# Altium schematic sheet MCU_Transceiver_Board.SchDoc
size B; SheetNumber: 1; SheetTotal: 6
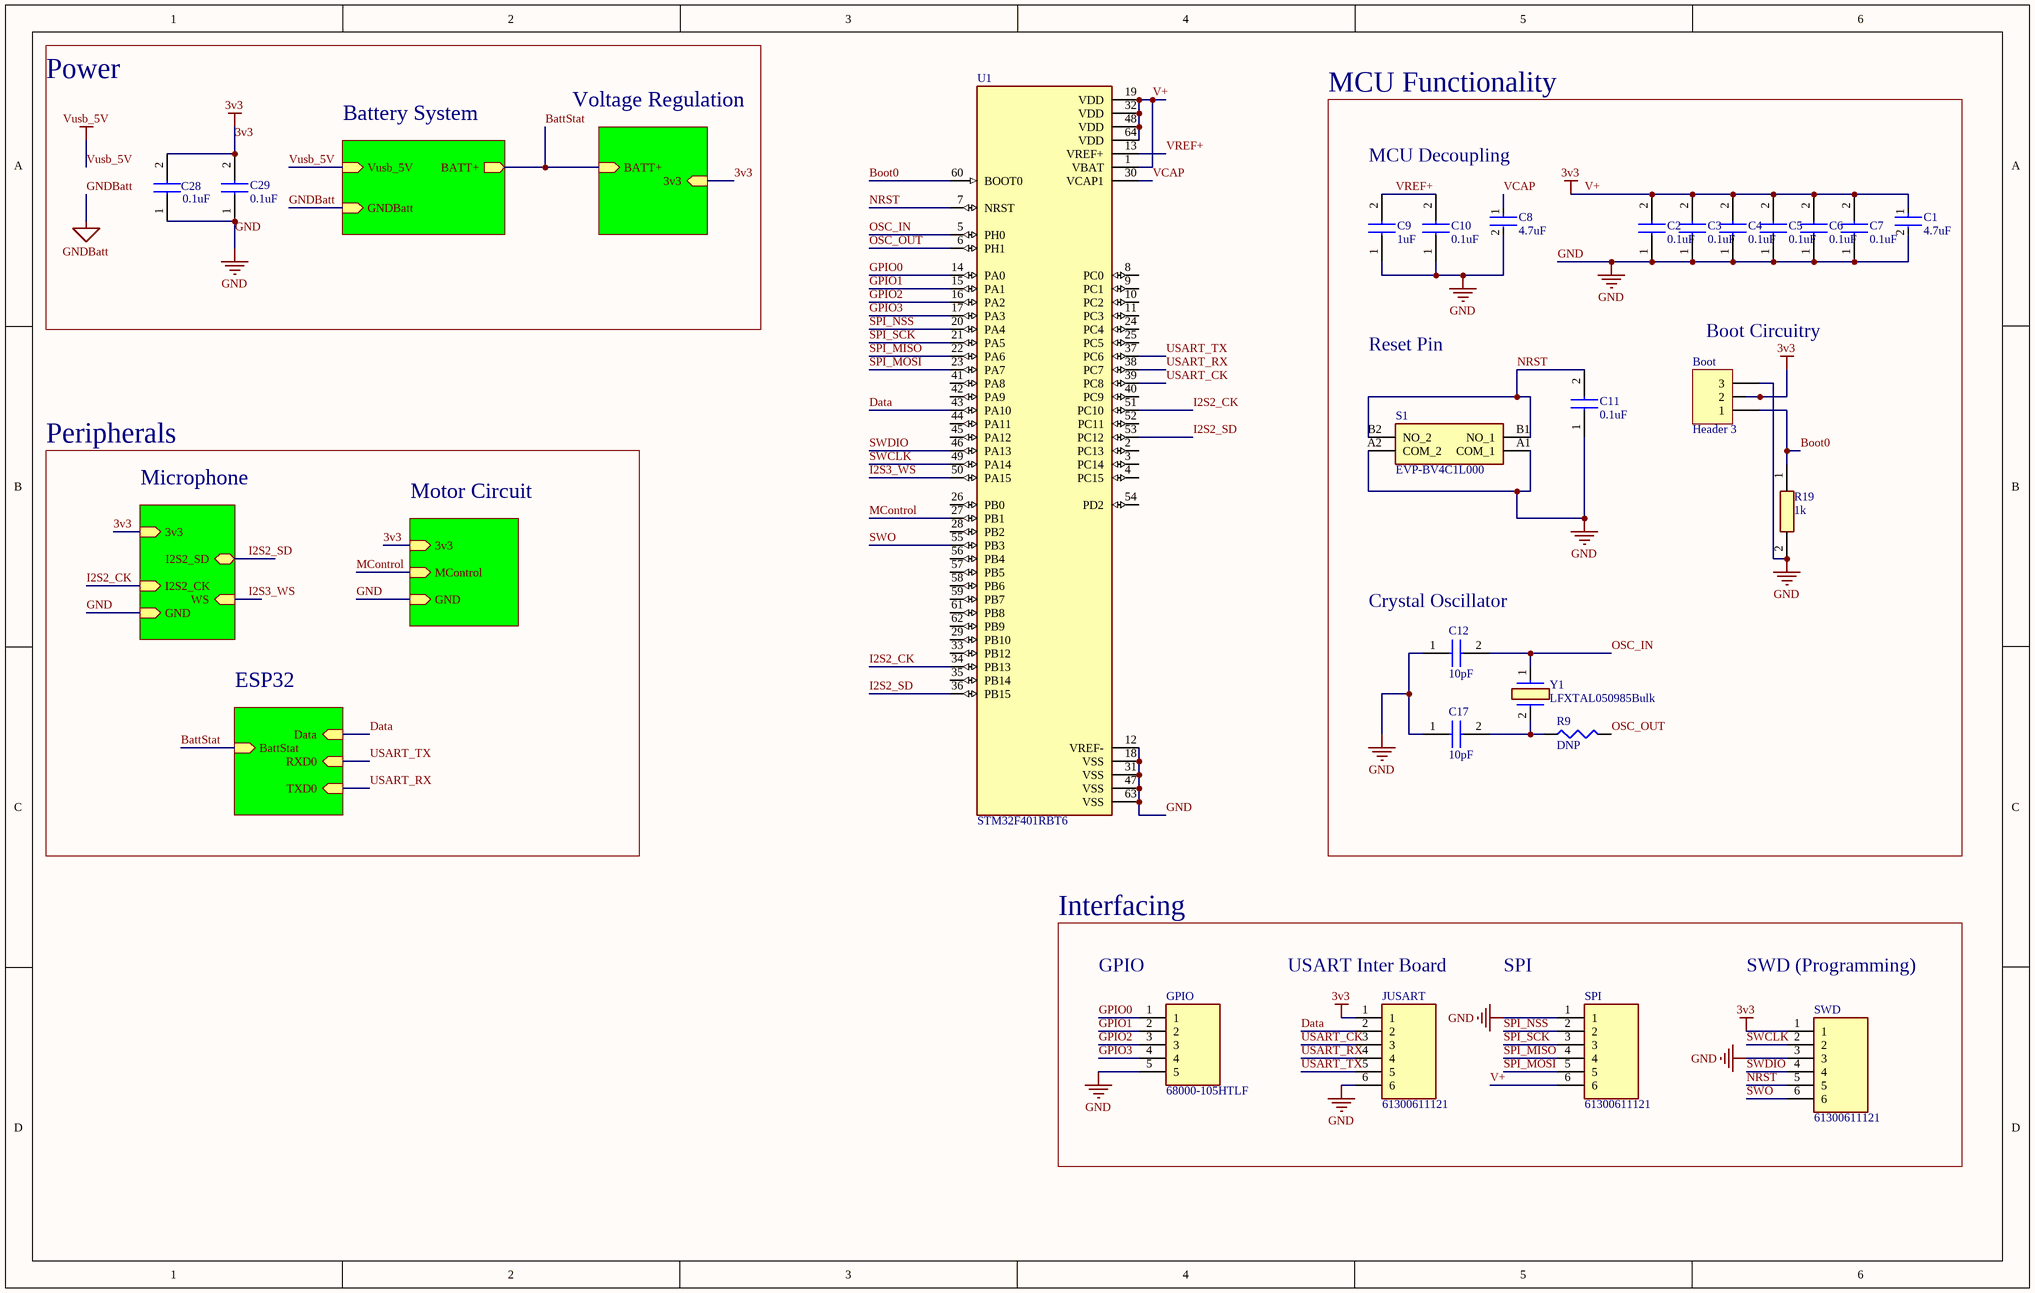
[diagram p0: MCU_Transceiver_Board.SchDoc]

## Parts
Boot  Header 3  [HDR1X3]
C1  4.7uF  [FP-1206-L_3_2_0_2-W_1_6_0-IPC_B]
C2  0.1uF  [CAPC3216X180N]
C3  0.1uF  [CAPC3216X180N]
C4  0.1uF  [CAPC3216X180N]
C5  0.1uF  [CAPC3216X180N]
C6  0.1uF  [CAPC3216X180N]
C7  0.1uF  [CAPC3216X180N]
C8  4.7uF  [FP-1206-L_3_2_0_2-W_1_6_0-IPC_B]
C9  1uF  [CAPC1608X90N]
C10  0.1uF  [CAPC3216X180N]
C11  0.1uF  [CAPC3216X180N]
C12  10pF  [CAPC1608X90N]
C17  10pF  [CAPC1608X90N]
C28  0.1uF  [CAPC3216X180N]
C29  0.1uF  [CAPC3216X180N]
GPIO  68000-105HTLF  [HDRV5W67P0X254_1X5_1270X241X858P]
JUSART  61300611121  [HDRV6W64P0X254_1X6_1524X254X869P]
R9  value DNP  [J1-0603]  (hidden comment: Res3)
R19  1k  [RESC3016X65N]
S1  EVP-BV4C1L000  [EVPBV4C1L000]
SPI  61300611121  [HDRV6W64P0X254_1X6_1524X254X869P]
SWD  61300611121  [HDRV6W64P0X254_1X6_1524X254X869P]
U1  STM32F401RBT6  [QFP50P1200X1200X160-64N]
Y1  LFXTAL050985Bulk  [LFXTAL050985Bulk]

## Blocks framed on the sheet
Power: C28 C29
MCU Functionality: Boot C1-C12 C17 R9 R19 S1 Y1
Interfacing: GPIO JUSART SPI SWD

## Sub-sheets
Battery System = Battery System: Vusb_5V (in), GNDBatt (in), BATT+ (out)
ESP32 = ESP32: Data (in), RXD0 (in), TXD0 (in), BattStat (in)
Microphone = Microphone: 3v3 (in), I2S2_SD (bidir), I2S2_CK (in), GND (in), WS (in)
Motor Circuit = Motor Circuit: 3v3 (in), GND (in), MControl (in)
Voltage Regulation = Voltage Regulation: BATT+ (in), 3v3 (in)

## Nets
3v3: Boot.2 C1.1 C2.2 C3.2 C4.2 C5.2 C6.2 C7.2 C28.2 C29.2 JUSART.1 SPI.6 SWD.1 U1.1(VBAT) U1.19(VDD) U1.32(VDD) U1.48(VDD) U1.64(VDD) ; sheet Microphone/3v3, sheet Voltage Regulation/3v3, sheet Motor Circuit/3v3  [also labelled V+]
GND: Boot.3 C1.2 C2.1 C3.1 C4.1 C5.1 C6.1 C7.1 C8.2 C9.1 C10.1 C11.1 C12.1 C17.1 C28.1 C29.1 GPIO.5 JUSART.6 R19.2 S1.A1(COM_1) S1.A2(COM_2) SPI.1 SWD.3 U1.12(VREF-) U1.18(VSS) U1.31(VSS) U1.47(VSS) U1.63(VSS) ; sheet Microphone/GND, sheet Motor Circuit/GND
GNDBatt: sheet Battery System/GNDBatt
Vusb_5V: sheet Battery System/Vusb_5V
BattStat: sheet Voltage Regulation/BATT+, sheet Battery System/BATT+, sheet ESP32/BattStat
Boot0: Boot.1 R19.1 U1.60(BOOT0)
Data: JUSART.2 U1.43(PA10) ; sheet ESP32/Data
GPIO0: GPIO.1 U1.14(PA0)
GPIO1: GPIO.2 U1.15(PA1)
GPIO2: GPIO.3 U1.16(PA2)
GPIO3: GPIO.4 U1.17(PA3)
I2S2_CK: U1.34(PB13) U1.51(PC10) ; sheet Microphone/I2S2_CK
I2S2_SD: U1.36(PB15) U1.53(PC12) ; sheet Microphone/I2S2_SD
I2S3_WS: U1.50(PA15) ; sheet Microphone/WS
MControl: U1.27(PB1) ; sheet Motor Circuit/MControl
NRST: C11.2 S1.B1(NO_1) S1.B2(NO_2) SWD.5 U1.7(NRST)
OSC_IN: C12.2 U1.5(PH0) Y1.1
OSC_OUT: R9.2 U1.6(PH1)
SPI_MISO: SPI.4 U1.22(PA6)
SPI_MOSI: SPI.5 U1.23(PA7)
SPI_NSS: SPI.2 U1.20(PA4)
SPI_SCK: SPI.3 U1.21(PA5)
SWCLK: SWD.2 U1.49(PA14)
SWDIO: SWD.4 U1.46(PA13)
SWO: SWD.6 U1.55(PB3)
USART_CK: JUSART.3 U1.39(PC8)
USART_RX: JUSART.4 U1.38(PC7) ; sheet ESP32/TXD0
USART_TX: JUSART.5 U1.37(PC6) ; sheet ESP32/RXD0
VCAP: C8.1 U1.30(VCAP1)
VREF+: C9.2 C10.2 U1.13(VREF+)
NetC17_2: C17.2 R9.1 Y1.2

Not connected (* = marked no-connect by the designer): U1 2(PC13) 3(PC14) 4(PC15) 8(PC0) 9(PC1) 10(PC2) 11(PC3) 24(PC4) 25(PC5) 26(PB0) 28(PB2) 29(PB10) 33(PB12) 35(PB14) 40(PC9) 41(PA8) 42(PA9) 44(PA11) 45(PA12) 52(PC11) 54(PD2) 56(PB4) 57(PB5) 58(PB6) 59(PB7) 61(PB8) 62(PB9)

## Notes on the sheet
- MCU Decoupling
- Reset Pin
- (near Boot) Boot Circuitry
- Peripherals
- (near C12) Crystal Oscillator
- (near GPIO) GPIO
- (near JUSART) USART Inter Board
- SPI
- SWD (Programming)

## Library data of the parts
Boot = Header 3: Header, 3-Pin; LatestRevisionDate: 17-Jul-2002; LatestRevisionNote: Re-released for DXP Platform.; Publisher: Altium Limited
C1 C8 = CMP-04427-012562-1: General Purpose Ceramic Capacitor, 1206, 4.7uF, 20%, X5R, 15%, 16V, 1206YD475MAT2A; Dissipation Factor: 5%; Tolerance: 20%; Length: 3.2mm; Min Operating Temperature: -55°C; Width: 0.063inch; Capacitance: 4.7uF; Dielectric: X5R; Case Code (Imperial): 1206; Termination: SMD/SMT; Package Quantity: 1; Depth: 1.6mm; Height: 0.07mm; Voltage Rating: 16V; Mount: Surface Mount; Lead Free: Lead Free; Construction: Flat; Case/Package: 1206; Max Operating Temperature: 85°C; Contact Plating: Tin; Voltage Rating (DC): 16V; Series: -; Case Code (Metric): 3216; RoHS Compliant: Yes; Thickness: 0.07inch; Packaging: Tape and Reel; Number of Pins: 2; Radiation Hardening: No
C2 C10 C11 C28 C29 = GCM31C5C1H104FA16L: Capacitor, GCM31C5C1H104FA16L, 1206; Manufacturer_Name: Murata Electronics; Datasheet Link: https://www.digikey.in/product-detail/en/murata-electronics/GCM31C5C1H104FA16L/490-GCM31C5C1H104FA16LCT-ND/11618925; Height: 1.8mm; Manufacturer_Part_Number: GCM31C5C1H104FA16L; Mouser Part Number: 81-GCM31C5C1H104FA16; Mouser Price/Stock: https://www.mouser.co.uk/ProductDetail/Murata-Electronics/GCM31C5C1H104FA16L?qs=rrS6PyfT74fke0d0BEF0PA%3D%3D; Arrow Part Number: GCM31C5C1H104FA16L; Arrow Price/Stock: https://www.arrow.com/en/products/gcm31c5c1h104fa16l/murata-manufacturing
C3-C7 = GCM31C5C1H104FA16L: Capacitor, C5C1H104FA16L; Manufacturer_Name: Murata Electronics; Datasheet Link: https://www.digikey.in/product-detail/en/murata-electronics/GCM31C5C1H104FA16L/490-GCM31C5C1H104FA16LCT-ND/11618925; Height: 1.8mm; Manufacturer_Part_Number: GCM31C5C1H104FA16L; Mouser Part Number: 81-GCM31C5C1H104FA16; Mouser Price/Stock: https://www.mouser.co.uk/ProductDetail/Murata-Electronics/GCM31C5C1H104FA16L?qs=rrS6PyfT74fke0d0BEF0PA%3D%3D; Arrow Part Number: GCM31C5C1H104FA16L; Arrow Price/Stock: https://www.arrow.com/en/products/gcm31c5c1h104fa16l/murata-manufacturing
C9 = 0603YC105JAT2A: Capacitor, 0603YC10JAT2A; Manufacturer_Name: AVX; Datasheet Link: http://www.mouser.com/catalog/supplier/library/pdf/AVXSurfaceMountCeramic.pdf; Height: 0.9mm; Manufacturer_Part_Number: 0603YC105JAT2A; Mouser Part Number: 581-0603YC105JAT2A; Mouser Price/Stock: https://www.mouser.co.uk/ProductDetail/AVX/0603YC105JAT2A/?qs=RCLU9o6%252BptxSjO%252BNXwzoBQ%3D%3D; Arrow Part Number: 0603YC105JAT2A; Arrow Price/Stock: https://www.arrow.com/en/products/0603yc105jat2a/avx
C12 C17 = 06035A100F4T4A: Capacitor, 10pF, 06035A100F4T4A; Manufacturer_Name: AVX; Datasheet Link: https://componentsearchengine.com/Datasheets/1/06031A100FAT2A.pdf; Height: 0.9mm; Manufacturer_Part_Number: 06035A100F4T4A; Mouser Part Number: 581-06035A100F4T4A; Mouser Price/Stock: https://www.mouser.co.uk/ProductDetail/AVX/06035A100F4T4A?qs=T3oQrply3y8l7Nbuh1mZXA%3D%3D
GPIO = 68000-105HTLF: Connector; Manufacturer_Name: Amphenol; Datasheet Link: https://www.arrow.com/en/products/68000-105htlf/amphenol-fci; Height: 8.58mm; Manufacturer_Part_Number: 68000-105HTLF; Mouser Part Number: 649-68000-105HTLF; Mouser Price/Stock: https://www.mouser.co.uk/ProductDetail/Amphenol-FCI/68000-105HTLF?qs=w%2Fv1CP2dgqrYgNyQVoiqDw%3D%3D; Arrow Part Number: 68000-105HTLF; Arrow Price/Stock: https://www.arrow.com/en/products/68000-105htlf/amphenol-fci
JUSART SPI SWD = 61300611121: Connector; Manufacturer_Name: Wurth Elektronik; Datasheet Link: https://componentsearchengine.com/Datasheets/2/61300611121.pdf; Height: 8.69mm; Manufacturer_Part_Number: 61300611121; Mouser Part Number: 710-61300611121; Mouser Price/Stock: https://www.mouser.co.uk/ProductDetail/Wurth-Elektronik/61300611121?qs=t4813l51qx%2FRpdf0Kp1HlQ%3D%3D
R9 = Res3: Resistor; Published: 8-Jun-2000; LatestRevisionDate: 29-May-2009; LatestRevisionNote: IPC-7351 Footprint Added.; PackageReference: J1-0603; Publisher: Altium Limited; PackageDescription: Chip Resistor
R19 = CRT1206-FZ-1001ELF: Resistor, CRT1206-FZ-1001ELF; Manufacturer_Name: Bourns; Datasheet Link: http://www.bourns.com/docs/Product-Datasheets/crt-as.pdf; Height: 0.65mm; Manufacturer_Part_Number: CRT1206-FZ-1001ELF; Mouser Part Number: 652-CRT1206FZ1001ELF; Mouser Price/Stock: https://www.mouser.co.uk/ProductDetail/Bourns/CRT1206-FZ-1001ELF?qs=Zq5ylnUbLm4KSc2M9tALXQ%3D%3D; Arrow Part Number: CRT1206-FZ-1001ELF; Arrow Price/Stock: https://www.arrow.com/en/products/crt1206-fz-1001elf/bourns?region=nac
S1 = EVP-BV4C1L000: Switch; Manufacturer_Name: Panasonic; Datasheet Link: https://www.mouser.de/datasheet/2/315/Panasonic_Switch__EVP_BV_Series__030122-2933967.pdf; Height: 3.7mm; Manufacturer_Part_Number: EVP-BV4C1L000; Mouser Part Number: 667-EVP-BV4C1L000; Mouser Price/Stock: https://www.mouser.co.uk/ProductDetail/Panasonic/EVP-BV4C1L000?qs=MyNHzdoqoQKwTvV8HYjCOw%3D%3D
U1 = STM32F401RBT6: ARMÂ® CortexÂ®-M4 STM32F4 Microcontroller IC 32-Bit 84MHz 128KB _128K x 8_ FLASH 64-LQFP _10x10_; MF: STMicroelectronics; Availability: Unavailable; MP: STM32F401RBT6; Price: None; Value: *; SnapEDA_Link: https://www.snapeda.com/parts/STM32F401RBT6/STMicroelectronics/view-part/49021/?ref=snap; Package: LQFP-64 STMicroelectronics
Y1 = LFXTAL050985Bulk: Crystal or Oscillator; Manufacturer_Name: IQD; Datasheet Link: https://componentsearchengine.com/Datasheets/1/LFXTAL050985Bulk.pdf; Height: 4.3mm; Manufacturer_Part_Number: LFXTAL050985Bulk; Mouser Part Number: 449-LFXTAL050985BULK; Mouser Price/Stock: https://www.mouser.com/Search/Refine.aspx?Keyword=449-LFXTAL050985BULK